# Altium schematic sheet input.SchDoc: PISO input board
size A3; Author: Francesco Sacchi <batt@develer.com>; Organization: Develer s.r.l.; Address1: via Mugellese 1/A; Address2: 50019 Campi Bisenzio; Address3: Firenze; Address4: ITALY; DocumentNumber: 1; Revision: 0; SheetNumber: 1; SheetTotal: 6
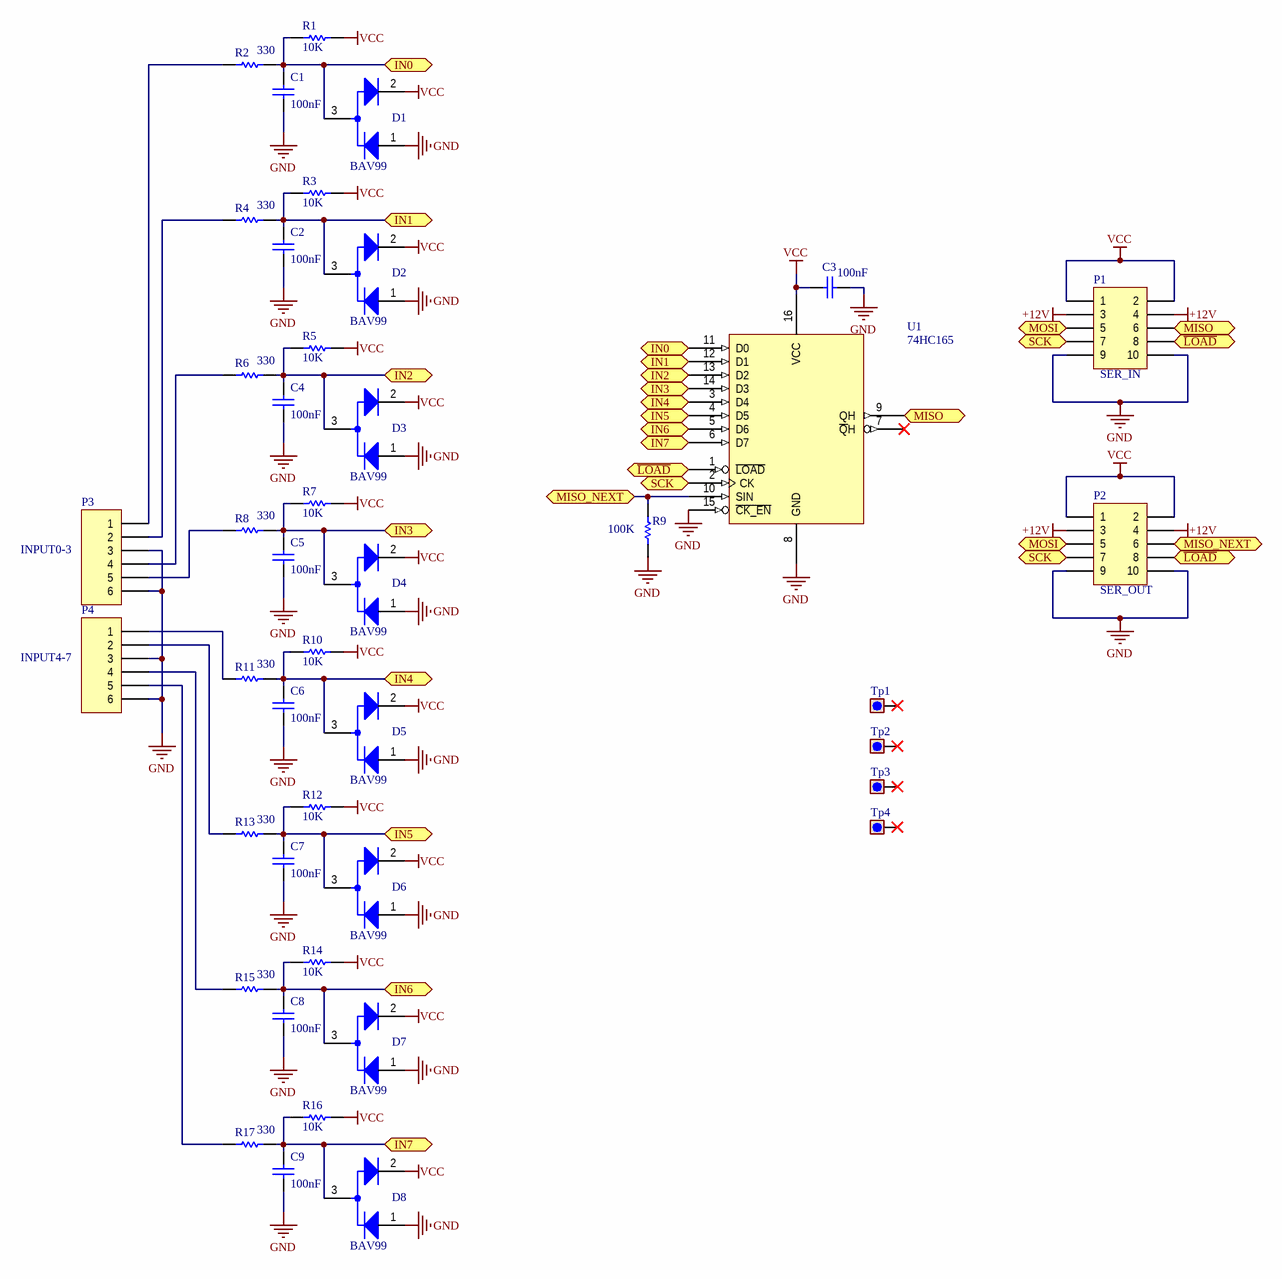
[diagram p0: input.SchDoc]

## Parts
C1  100nF  [0603_[1608]]
C2  100nF  [0603_[1608]]
C3  100nF  [0603_[1608]]
C4  100nF  [0603_[1608]]
C5  100nF  [0603_[1608]]
C6  100nF  [0603_[1608]]
C7  100nF  [0603_[1608]]
C8  100nF  [0603_[1608]]
C9  100nF  [0603_[1608]]
D1  BAV99  [SOT-23]
D2  BAV99  [SOT-23]
D3  BAV99  [SOT-23]
D4  BAV99  [SOT-23]
D5  BAV99  [SOT-23]
D6  BAV99  [SOT-23]
D7  BAV99  [SOT-23]
D8  BAV99  [SOT-23]
P1  SER_IN  [HEADER_2X5_2.54MM_THD_BOXED]
P2  SER_OUT  [HEADER_2X5_2.54MM_THD_BOXED]
P3  INPUT0-3  [TBLOCK_1X6_3.5MM_HOR_THD]
P4  INPUT4-7  [TBLOCK_1X6_3.5MM_HOR_THD]
R1  10K  [0603_[1608]]
R2  330  [0603_[1608]]
R3  10K  [0603_[1608]]
R4  330  [0603_[1608]]
R5  10K  [0603_[1608]]
R6  330  [0603_[1608]]
R7  10K  [0603_[1608]]
R8  330  [0603_[1608]]
R9  100K  [0603_[1608]]
R10  10K  [0603_[1608]]
R11  330  [0603_[1608]]
R12  10K  [0603_[1608]]
R13  330  [0603_[1608]]
R14  10K  [0603_[1608]]
R15  330  [0603_[1608]]
R16  10K  [0603_[1608]]
R17  330  [0603_[1608]]
Tp1  (no value)  [Hole_M3x6mm]  (no BOM)
Tp2  (no value)  [Hole_M3x6mm]  (no BOM)
Tp3  (no value)  [Hole_M3x6mm]  (no BOM)
Tp4  (no value)  [Hole_M3x6mm]  (no BOM)
U1  74HC165  [SOIC16]

## Ports
IN0, IN1, IN2, IN3, IN4, IN5, IN6, IN7, MISO, MISO_NEXT, MOSI, SCK, ~{LOAD}

## Nets
+12V: P1.3 P1.4 P2.3 P2.4
GND: C1.1 C2.1 C3.1 C4.1 C5.1 C6.1 C7.1 C8.1 C9.1 D1.1 D2.1 D3.1 D4.1 D5.1 D6.1 D7.1 D8.1 P1.9 P1.10 P2.9 P2.10 P3.3 P3.6 P4.3 P4.6 R9.1 U1.8(GND) U1.15(~{CK_EN})
VCC: C3.2 D1.2 D2.2 D3.2 D4.2 D5.2 D6.2 D7.2 D8.2 P1.1 P1.2 P2.1 P2.2 R1.2 R3.2 R5.2 R7.2 R10.2 R12.2 R14.2 R16.2 U1.16(VCC)
IN0: C1.2 D1.3 R1.1 R2.1 U1.11(D0) ; port IN0
IN1: C2.2 D2.3 R3.1 R4.1 U1.12(D1) ; port IN1
IN2: C4.2 D3.3 R5.1 R6.1 U1.13(D2) ; port IN2
IN3: C5.2 D4.3 R7.1 R8.1 U1.14(D3) ; port IN3
IN4: C6.2 D5.3 R10.1 R11.1 U1.3(D4) ; port IN4
IN5: C7.2 D6.3 R12.1 R13.1 U1.4(D5) ; port IN5
IN6: C8.2 D7.3 R14.1 R15.1 U1.5(D6) ; port IN6
IN7: C9.2 D8.3 R16.1 R17.1 U1.6(D7) ; port IN7
~{LOAD}: P1.8 P2.8 U1.1(~{LOAD}) ; port ~{LOAD}
MISO: P1.6 U1.9(QH) ; port MISO
MISO_NEXT: P2.6 R9.2 U1.10(SIN) ; port MISO_NEXT
MOSI: P1.5 P2.5 ; port MOSI
SCK: P1.7 P2.7 U1.2(CK) ; port SCK
NetP3_1: P3.1 R2.2
NetP3_2: P3.2 R4.2
NetP3_4: P3.4 R6.2
NetP3_5: P3.5 R8.2
NetP4_1: P4.1 R11.2
NetP4_2: P4.2 R13.2
NetP4_4: P4.4 R15.2
NetP4_5: P4.5 R17.2

Not connected (* = marked no-connect by the designer): Tp1 1*; Tp2 1*; Tp3 1*; Tp4 1*; U1 7(~{Q}H)*

## Notes on the sheet
- Title:
- Author:
- License:
- BSD
- Rev:
- Size:
- A3
- File:
- Date:
- Time:
- Sheet
- of

## Library data of the parts
C1-C9 = Cap: Ceramic X5R 6.3V, 10V; Value: 10nF; Published: 8-Jun-2000; Revision: July-2002: Re-released for DXP Platform.; Publisher: Altium Limited
D1-D8 = BAV99: SOT23
P1 P2 = Header 5X2: Header, 5-Pin, Dual row; LatestRevisionDate: 17-Jul-2002; LatestRevisionNote: Re-released for DXP Platform.; Publisher: Altium Limited
P3 P4 = Header 6: Header, 6-Pin; LatestRevisionDate: 17-Jul-2002; LatestRevisionNote: Re-released for DXP Platform.; Publisher: Altium Limited
R1-R17 = Res1: Resistor; Value: 1K; Published: 8-Jun-2000; Revision: July-2002: Re-released for DXP Platform.; Publisher: Altium Limited
Tp1-Tp4 = Test_point